# Altium schematic sheet NewInfSche.SchDoc
size A3
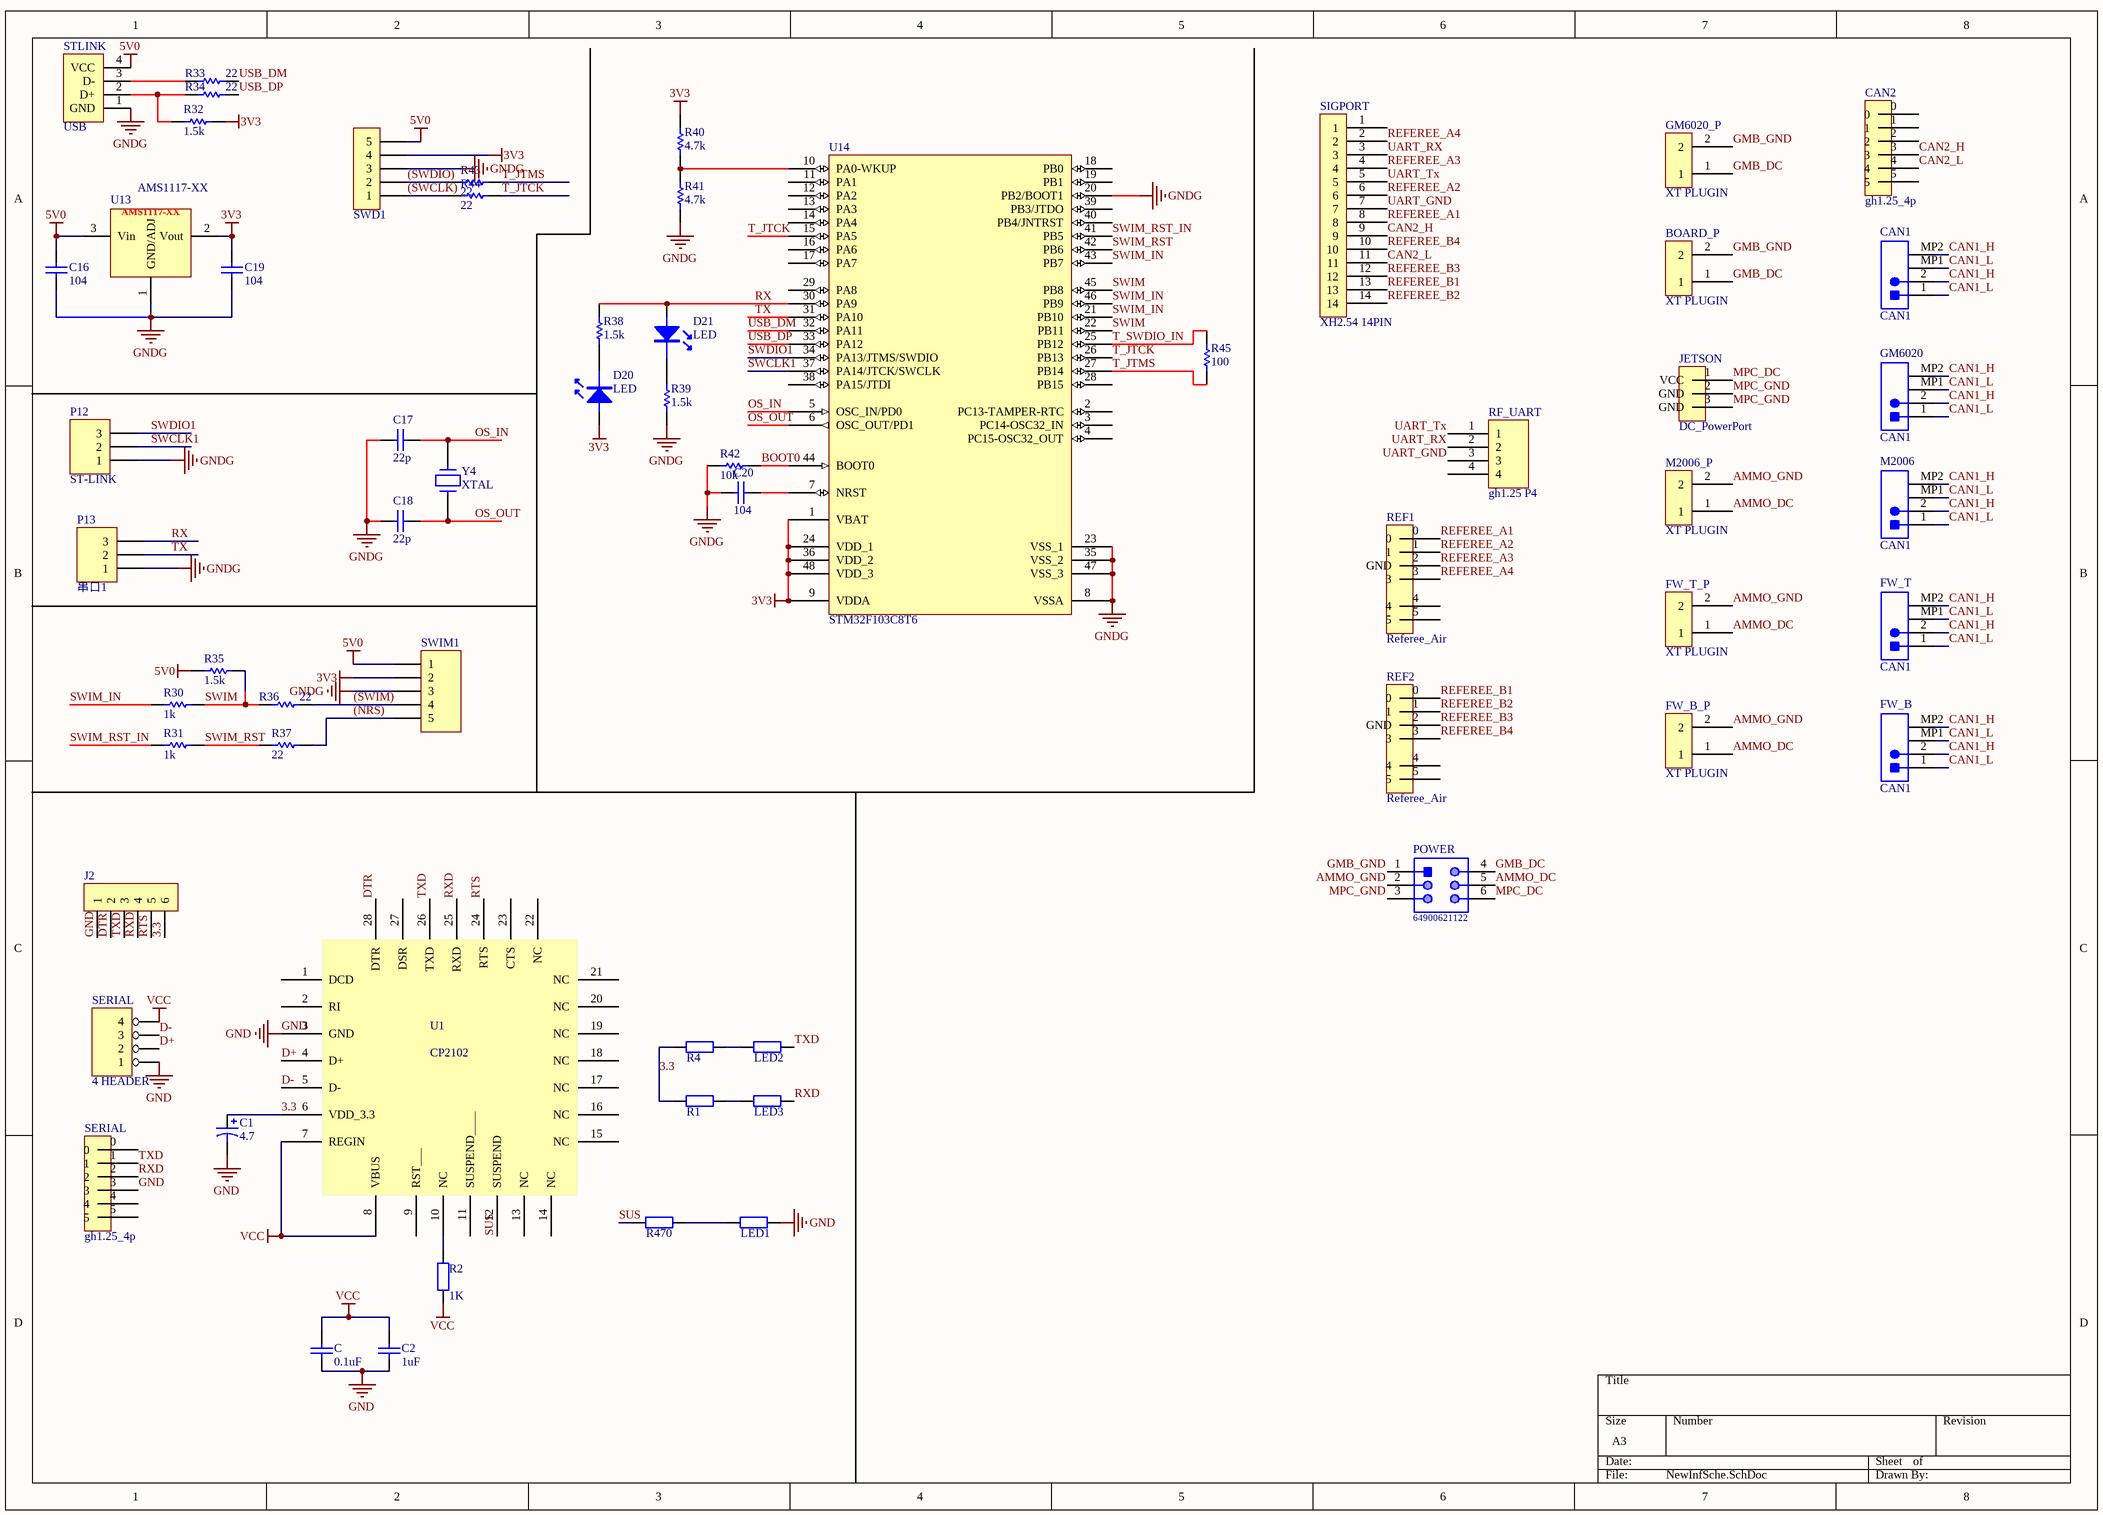
[diagram p0: NewInfSche.SchDoc]

## Parts
(Parts that share a designator on the sheet are numbered #1, #2 ... from top to bottom, then left to right.)
BOARD_P  XT PLUGIN  [XT30-M]
C  value 0.1uF  [0805]  (hidden comment: Cap)
C1  4.7  [2P-150]
C2  value 1uF  [0805]  (hidden comment: Cap)
C16  value 104  [C0805]  (hidden comment: Cap)
C17  value 22p  [C0805]  (hidden comment: Cap)
C18  value 22p  [C0805]  (hidden comment: Cap)
C19  value 104  [C0805]  (hidden comment: Cap)
C20  value 104  [C0805]  (hidden comment: Cap)
CAN1  CAN1  [JST-BM02B-GHS-TBT_V]
CAN2  gh1.25_4p  [GH1.25-LS-4P]
D20  LED  [0805_LED]
D21  LED  [0805_LED]
FW_B  CAN1  [JST-BM02B-GHS-TBT_V]
FW_B_P  XT PLUGIN  [XT30-M]
FW_T  CAN1  [JST-BM02B-GHS-TBT_V]
FW_T_P  XT PLUGIN  [XT30-M]
GM6020  CAN1  [JST-BM02B-GHS-TBT_V]
GM6020_P  XT PLUGIN  [XT30-M]
J2  (no value)  [HDR2.54-LI-6P]
JETSON  DC_PowerPort  [DC-012]
LED1  Res2  [0603]  (value not drawn)
LED2  Res2  [0603]  (value not drawn)
LED3  Res2  [0603]  (value not drawn)
M2006  CAN1  [JST-BM02B-GHS-TBT_V]
M2006_P  XT PLUGIN  [XT30-M]
P12  ST-LINK  [SIP3-1.27]
P13  串口1  [SIP3-1.27]
POWER  64900621122  [64900621122]
R1  Res2  [R]  (value not drawn)
R2  value 1K  [0805]  (hidden comment: Res2)
R4  Res2  [R]  (value not drawn)
R30  value 1k  [C0805]  (hidden comment: RES)
R31  value 1k  [C0805]  (hidden comment: RES)
R32  value 1.5k  [C0805]  (hidden comment: RES)
R33  value 22  [C0805]  (hidden comment: RES)
R34  value 22  [C0805]  (hidden comment: RES)
R35  value 1.5k  [C0805]  (hidden comment: RES)
R36  value 22  [C0805]  (hidden comment: RES)
R37  value 22  [C0805]  (hidden comment: RES)
R38  value 1.5k  [C0805]  (hidden comment: RES)
R39  value 1.5k  [C0805]  (hidden comment: RES)
R40  value 4.7k  [C0805]  (hidden comment: RES)
R41  value 4.7k  [C0805]  (hidden comment: RES)
R42  value 10k  [C0805]  (hidden comment: RES)
R43  value 22  [C0805]  (hidden comment: RES)
R44  value 22  [C0805]  (hidden comment: RES)
R45  value 100  [C0805]  (hidden comment: RES)
R470  Res2  [0805]  (value not drawn)
REF1  Referee_Air  [M8 CONNECTOR-LS]
REF2  Referee_Air  [M8 CONNECTOR-LS]
RF_UART  gh1.25 P4  [GH1.25-LS-4P]
SERIAL#1  4 HEADER  [USB-A/S_D]
SERIAL#2  gh1.25_4p  [GH1.25-LS-4P]
SIGPORT  XH2.54 14PIN  [DC-2.54-L-Z-14P]
STLINK  USB  [USB-A/S_D]
SWD1  Head5  [HDR2.54-LI-5P]  (value not drawn)
SWIM1  Header 5  [HDR2.54-LI-5P]  (value not drawn)
U1  CP2102  [CP2102]
U13  AMS1117-XX  [SOT_223]
U14  STM32F103C8T6  [LQFP48_N]
Y4  XTAL  [XTAL_2]

## Nets
3V3: C19.2 D20.1(A) R32.2 R40.2 SWD1.4 SWIM1.2 U13.2(Vout) U14.1(VBAT) U14.9(VDDA) U14.24(VDD_1) U14.36(VDD_2) U14.48(VDD_3)
5V0: C16.2 R35.1 STLINK.4(VCC) SWD1.5 SWIM1.1 U13.3(Vin)
GND: C.2 C1.2 C2.2 J2.1 LED1.1 SERIAL#1.1 SERIAL#2.3 U1.3(GND)
GNDG: C16.1 C17.1 C18.1 C19.1 C20.1 P12.1 P13.1 R39.1 R41.1 R42.1 STLINK.1(GND) SWD1.3 SWIM1.3 U13.1(GND/ADJ) U14.8(VSSA) U14.20(PB2/BOOT1) U14.23(VSS_1) U14.35(VSS_2) U14.47(VSS_3)
VCC: C.1 C2.1 R2.1 SERIAL#1.4 U1.7(REGIN) U1.8(VBUS)
3.3: C1.1 J2.6 R1.1 R4.1 U1.6(VDD_3.3)
(NRS): R37.1 SWIM1.5
(SWCLK): R44.1 SWD1.1
(SWDIO): R43.1 SWD1.2
(SWIM): R36.1 SWIM1.4
AMMO_DC: FW_B_P.1 FW_T_P.1 M2006_P.1 POWER.5
AMMO_GND: FW_B_P.2 FW_T_P.2 M2006_P.2 POWER.2
BOOT0: R42.2 U14.44(BOOT0)
CAN1_H: CAN1.2 CAN1.MP2 FW_B.2 FW_B.MP2 FW_T.2 FW_T.MP2 GM6020.2 GM6020.MP2 M2006.2 M2006.MP2
CAN1_L: CAN1.1 CAN1.MP1 FW_B.1 FW_B.MP1 FW_T.1 FW_T.MP1 GM6020.1 GM6020.MP1 M2006.1 M2006.MP1
CAN2_H: CAN2.3 SIGPORT.9
CAN2_L: CAN2.4 SIGPORT.11
D+: SERIAL#1.2 U1.4(D+)
D-: SERIAL#1.3 U1.5(D-)
DTR: J2.2 U1.28(DTR)
GMB_DC: BOARD_P.1 GM6020_P.1 POWER.4
GMB_GND: BOARD_P.2 GM6020_P.2 POWER.1
MPC_DC: JETSON.1(VCC) POWER.6
MPC_GND: JETSON.2(GND) JETSON.3(GND) POWER.3
OS_IN: C17.2 U14.5(OSC_IN/PD0) Y4.2
OS_OUT: C18.2 U14.6(OSC_OUT/PD1) Y4.1
REFEREE_A1: REF1.0 SIGPORT.8
REFEREE_A2: REF1.1 SIGPORT.6
REFEREE_A3: REF1.2(GND) SIGPORT.4
REFEREE_A4: REF1.3 SIGPORT.2
REFEREE_B1: REF2.0 SIGPORT.13
REFEREE_B2: REF2.1 SIGPORT.14
REFEREE_B3: REF2.2(GND) SIGPORT.12
REFEREE_B4: REF2.3 SIGPORT.10
RTS: J2.5 U1.24(RTS)
RX: D21.1(A) P13.3 R38.2 U14.30(PA9)
RXD: J2.4 LED3.1 SERIAL#2.2 U1.25(RXD)
SUS: R470.1 U1.12(SUSPEND)
SWCLK1: P12.2 U14.37(PA14/JTCK/SWCLK)
SWDIO1: P12.3 U14.34(PA13/JTMS/SWDIO)
SWIM: R30.2 R35.2 R36.2 U14.22(PB11) U14.45(PB8)
SWIM_IN: R30.1 U14.21(PB10) U14.43(PB7) U14.46(PB9)
SWIM_RST: R31.2 R37.2 U14.42(PB6)
SWIM_RST_IN: R31.1 U14.41(PB5)
T_JTCK: R44.2 U14.15(PA5) U14.26(PB13)
T_JTMS: R43.2 R45.1 U14.27(PB14)
T_SWDIO_IN: R45.2 U14.25(PB12)
TX: P13.2 U14.31(PA10)
TXD: J2.3 LED2.1 SERIAL#2.1 U1.26(TXD)
UART_GND: RF_UART.3 SIGPORT.7
UART_RX: RF_UART.2 SIGPORT.3
UART_Tx: RF_UART.1 SIGPORT.5
USB_DM: R33.2 U14.32(PA11)
USB_DP: R34.2 U14.33(PA12)
NetC20_2: C20.2 U14.7(NRST)
NetD20_2: D20.2(K) R38.1
NetD21_2: D21.2(K) R39.2
NetLED1_2: LED1.2 R470.2
NetLED2_2: LED2.2 R4.2
NetLED3_2: LED3.2 R1.2
NetR2_2: R2.2 U1.10(NC)
NetR32_1: R32.1 R34.1 STLINK.2(D+)
NetR33_1: R33.1 STLINK.3(D-)
NetR40_1: R40.1 R41.2 U14.10(PA0-WKUP)

Not connected (* = marked no-connect by the designer): CAN2 0 1 2 5; REF1 4 5; REF2 4 5; RF_UART 4; SERIAL#2 0 4 5; SIGPORT 1; U1 1(DCD) 2(RI) 9(RST___) 11(SUSPEND____) 13(NC) 14(NC) 15(NC) 16(NC) 17(NC) 18(NC) 19(NC) 20(NC) 21(NC) 22(NC) 23(CTS) 27(DSR); U14 2(PC13-TAMPER-RTC) 3(PC14-OSC32_IN) 4(PC15-OSC32_OUT) 11(PA1) 12(PA2) 13(PA3) 14(PA4) 16(PA6) 17(PA7) 18(PB0) 19(PB1) 28(PB15) 29(PA8) 38(PA15/JTDI) 39(PB3/JTDO) 40(PB4/JNTRST)

## Library data of the parts
C C2 = Cap: Capacitor; Published: 8-Jun-2000; LatestRevisionDate: 17-Jul-2002; LatestRevisionNote: Re-released for DXP Platform.; PackageReference: RAD-0.3; Publisher: Altium Limited
C1 = Cap Pol1: Polarized Capacitor (Radial); Value: 1uF; Published: 8-Jun-2000; LatestRevisionDate: 17-Jul-2002; LatestRevisionNote: Re-released for DXP Platform.; PackageReference: RB7.6-15; Publisher: Altium Limited
CAN1 FW_B FW_T GM6020 M2006 = CMP-2000-05957-1: Disconnectable Crimp Style Connector, Pitch 1.25 mm, 1 x 2 Position, Height 4.05 mm, -25 to 85 degC, RoHS, Tape and Reel; Manufacturer: JST-Sales-America-Inc.; Connector Type: Header,Shrouded; Number of Positions Loaded: All; Pitch: 0.049"(1.25mm); Number of Positions: 2; Family: RectangularConnectors-Headers,MalePins; Contact Finish: Tin; Contact Type: OuterShroudContact; Number of Rows: 1; Row Spacing: -; Datasheet Version: 05/2016; Fastening Type: LockingRamp; Contact Mating Length: -; Packaging: Digi-Reel®; Manufacturer URL: http://www.jst.com/home2.html; Termination: Solder; Package Description: Disconnectable Crimp Style Connector, Pitch 1.25 mm, 1 x 2 Position, Height 4.05 mm; Features: SolderRetention; Color: Natural; Datasheet URL: http://www.jst-mfg.com/product/pdf/eng/eGH.pdf; Package Reference: BM02B-GHS-TBT; Series: GH; Contact Finish Thickness: -; Mounting Type: SurfaceMount; Mounting Technology: SurfaceMount; Category: Connectors,Interconnects
J2 = CON6: Connector
LED1-LED3 R1 R4 R470 = Res2: Resistor; Value: 1K; Published: 8-Jun-2000; LatestRevisionDate: 17-Jul-2002; LatestRevisionNote: Re-released for DXP Platform.; PackageReference: AXIAL-0.4; Publisher: Altium Limited
P12 P13 = Header 3: Header, 3-Pin; LatestRevisionDate: 17-Jul-2002; LatestRevisionNote: Re-released for DXP Platform.; Publisher: Altium Limited
POWER = CMP-1502-00495-1: THT Male Header WR-MPC4, Vertical, Dual Row, pitch 4.2 mm, 6 pins; Manufacturer: Wurth Elektronik; Pin Number: 6; Pitch: 4.2mm; Working Voltage: 600VAC; Contact Resistance: 10mOhm; Packaging: Tray; Orientation: Vertical; Gender: Male; Manufacturer URL: http://www.we-online.de; Operating Temperature: -40to105degC; Publisher: WurthElektronik; Part Number: 64900621122; Mounting Technology: THT; Datasheet URL: https://katalog.we-online.de/em/datasheet/6490xx21122.pdf; Package Reference: 64900621122
R2 = Res2: Resistor; Published: 8-Jun-2000; LatestRevisionDate: 17-Jul-2002; LatestRevisionNote: Re-released for DXP Platform.; PackageReference: AXIAL-0.4; Publisher: Altium Limited
SERIAL#1 = 4 HEADER: 4 Pin Header
STLINK = USB_G
SWD1 = HEAD 5
SWIM1 = Header 5: Header, 5-Pin; LatestRevisionDate: 17-Jul-2002; LatestRevisionNote: Re-released for DXP Platform.; Publisher: Altium Limited
U1 = Component_2
U13 = AMS1117-XX: AMS   800mA LOW DROPOUT VOLTAGE REGULATOR
U14 = STM32F103C8T6: STM32 ARM-based 32-bit MCU with 64 Kbytes Flash, 48-pin LQFP, Industrial Temperature; Published: 30-May-2008; DatasheetVersion: rev6, Mar-2008; PackageVersion: Mar-2008; PackageReference: LQFP48; Publisher: Altium Limited; PackageDescription: 48-Pin Low-Profile Quad Flat Pack, 7 x 7 mm Body, 0.5 mm Pitch (LQFP48); ComponentLink1Description: Manufacturer Link; ComponentLink1URL: www.st.com/stm32; ComponentLink2Description: Datasheet; ComponentLink2URL: http://www.st.com/stonline/products/literature/ds/13587.pdf